# EAGLE design ALIM (EAGLE 9.6.2)

## Sheet 1 of 2: Carte Alim - APU
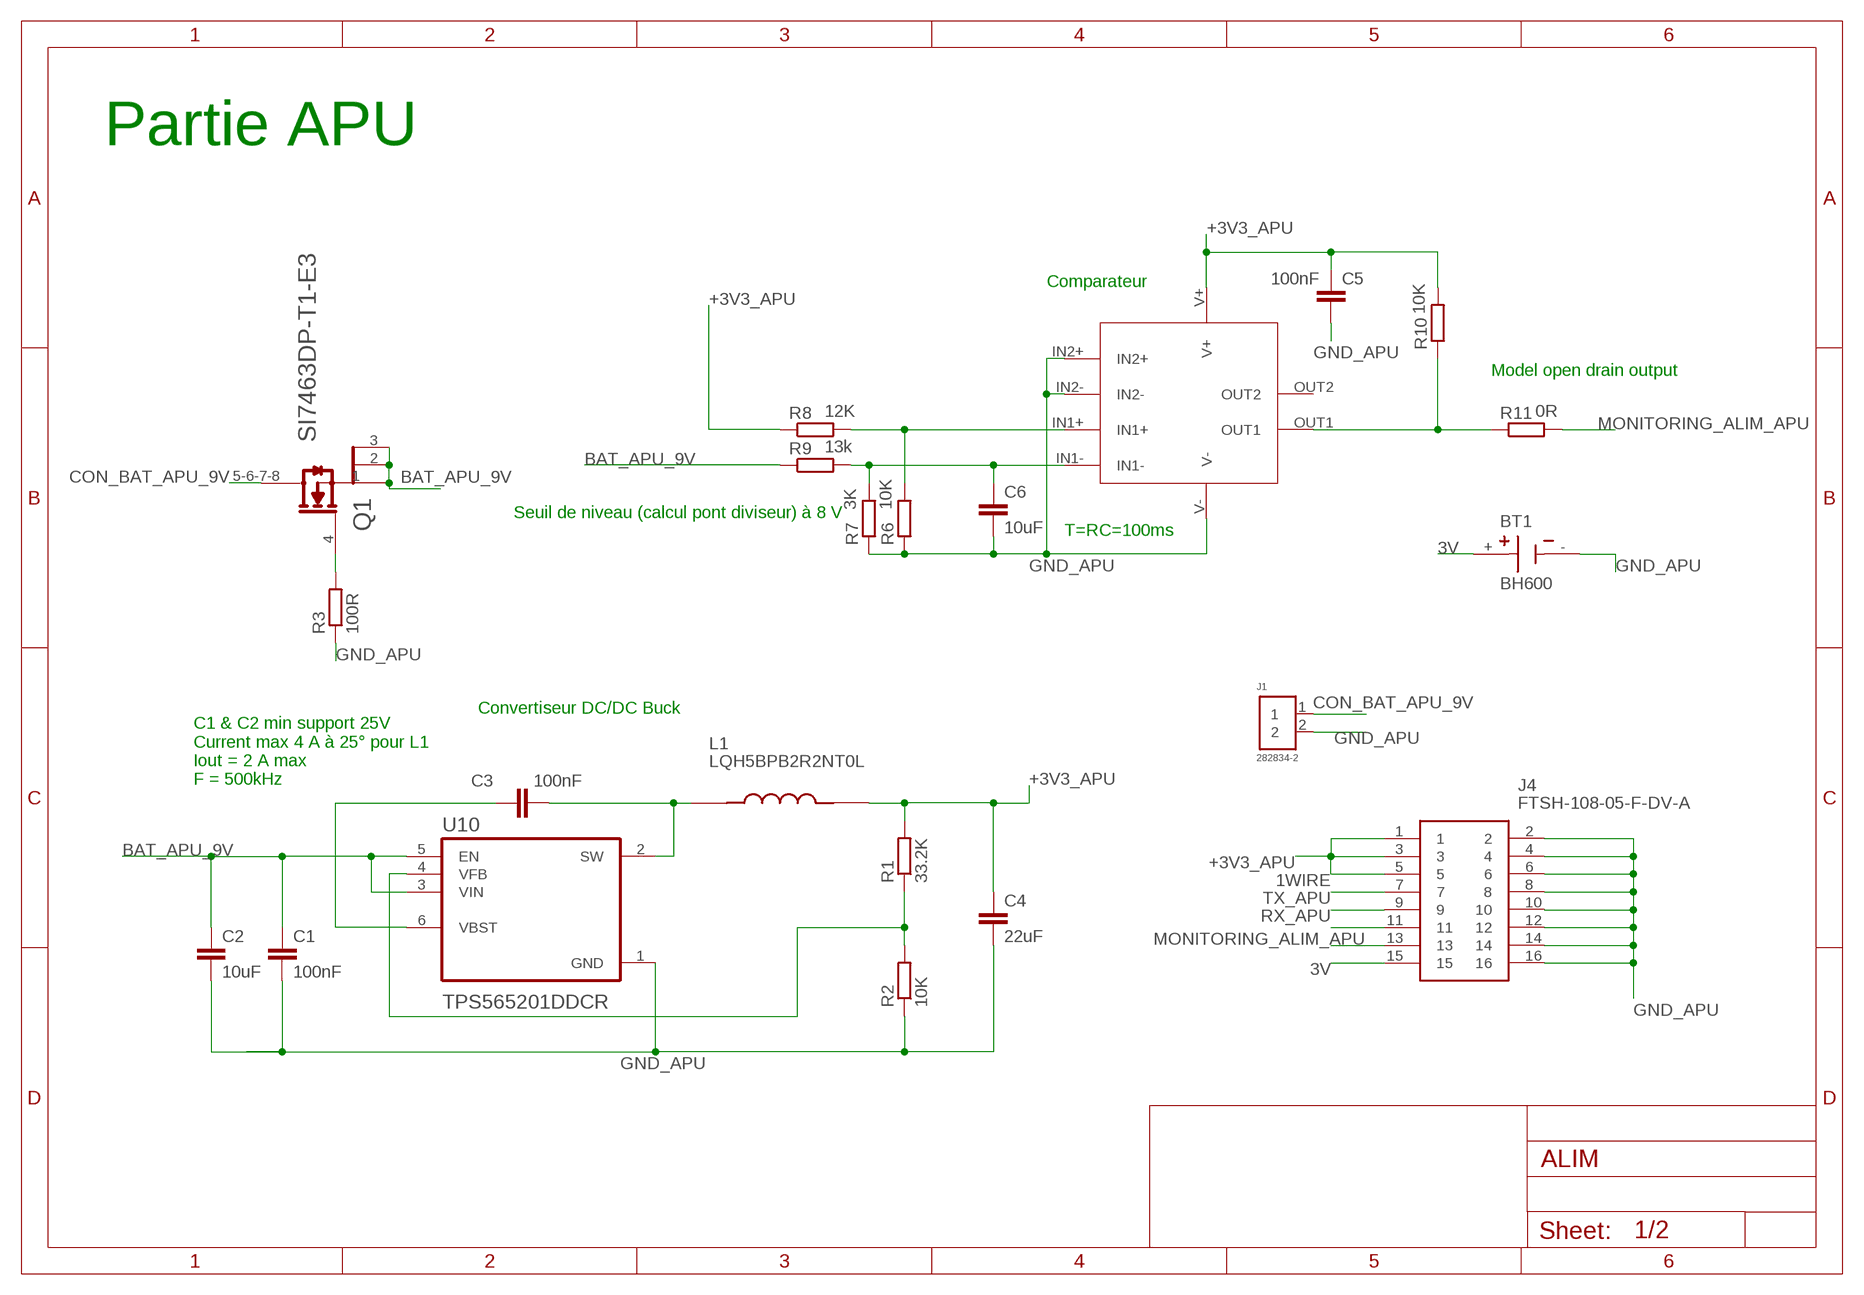
[diagram p0: schematic, sheet 1]

### Parts
BT1  BH600  [BAT_BH600]
C1  100nF  C-EUC0805  [C0805]
C2  10uF  C-EUC0805  [C0805]
C3  100nF  C-EUC0805  [C0805]
C4  22uF  C-EUC0805  [C0805]
C5  100nF  C-EUC0805  [C0805]
C6  10uF  C-EUC0805  [C0805]
J1  282834-2  [CONN_282834-2]
J4  FTSH-108-05-F-DV-A  [FTSH-108-XX-YYY-DV-A]
L1  LQH5BPB2R2NT0L  [IND_LQH5BPB2R2NT0L]
Q1  VISHAY_SI7463DP-T1-E3VISHAY_SI7463DP-T1-E3_0_0  [VISHAY_SI7463DP-T1-E3_0]
R1  33.2K  R-EU_R0603  [R0603]
R2  10K  R-EU_R0603  [R0603]
R3  100R  R-EU_R0603  [R0603]
R6  10K  R-EU_R0603  [R0603]
R7  3K  R-EU_R0603  [R0603]
R8  12K  R-EU_R0603  [R0603]
R9  13k  R-EU_R0603  [R0603]
R10  10K  R-EU_R0603  [R0603]
R11  0R  R-EU_R0603  [R0603]
TLV1  TLV9022  [TLV9022]
U10  TPS565201DDCR  [SOT95P280X110-6N]

### Nets
1WIRE [50Ohms]: J4.7
3V [Power]: BT1.+ J4.15
+3V3_APU [Power]: C4.1 C5.1 J4.1 J4.3 J4.5 L1.2 R1.2 R8.1 R10.2 TLV1.V+
BAT_APU_9V [Power]: C1.1 C2.1 Q1.1(1_S) Q1.2(2_S) Q1.3(3_S) R9.1 U10.3(VIN) U10.5(EN)
CON_BAT_APU_9V: J1.1 Q1.5-6-7-8(D)
GND_APU: BT1.- C1.2 C2.2 C4.2 C5.2 C6.2 J1.2 J4.2 J4.4 J4.6 J4.8 J4.10 J4.12 J4.14 J4.16 R2.1 R3.1 R6.1 R7.1 TLV1.IN2+ TLV1.IN2- TLV1.V- U10.1(GND)
MONITORING_ALIM_APU: J4.13 R11.2
N$1: Q1.4(G) R3.2
N$37: C3.1 U10.6(VBST)
N$38 [Power]: C3.2 L1.1 U10.2(SW)
N$39: R1.1 R2.2 U10.4(VFB)
N$42: R6.2 R8.2 TLV1.IN1+
N$43: C6.1 R7.2 R9.2 TLV1.IN1-
N$45: R10.1 R11.1 TLV1.OUT1
RX_APU [50Ohms]: J4.11
TX_APU [50Ohms]: J4.9
Unconnected: TLV1.OUT2

### Notes on the sheet
- Partie APU
- Comparateur
- Model open drain output
- Seuil de niveau (calcul pont diviseur) à 8 V
- T=RC=100ms
- Convertiseur DC/DC Buck
- C1 & C2 min support 25V
  Current max 4 A à 25° pour L1
  Iout = 2 A max
  F = 500kHz

## Sheet 2 of 2: Carte Alim - Séquenceur
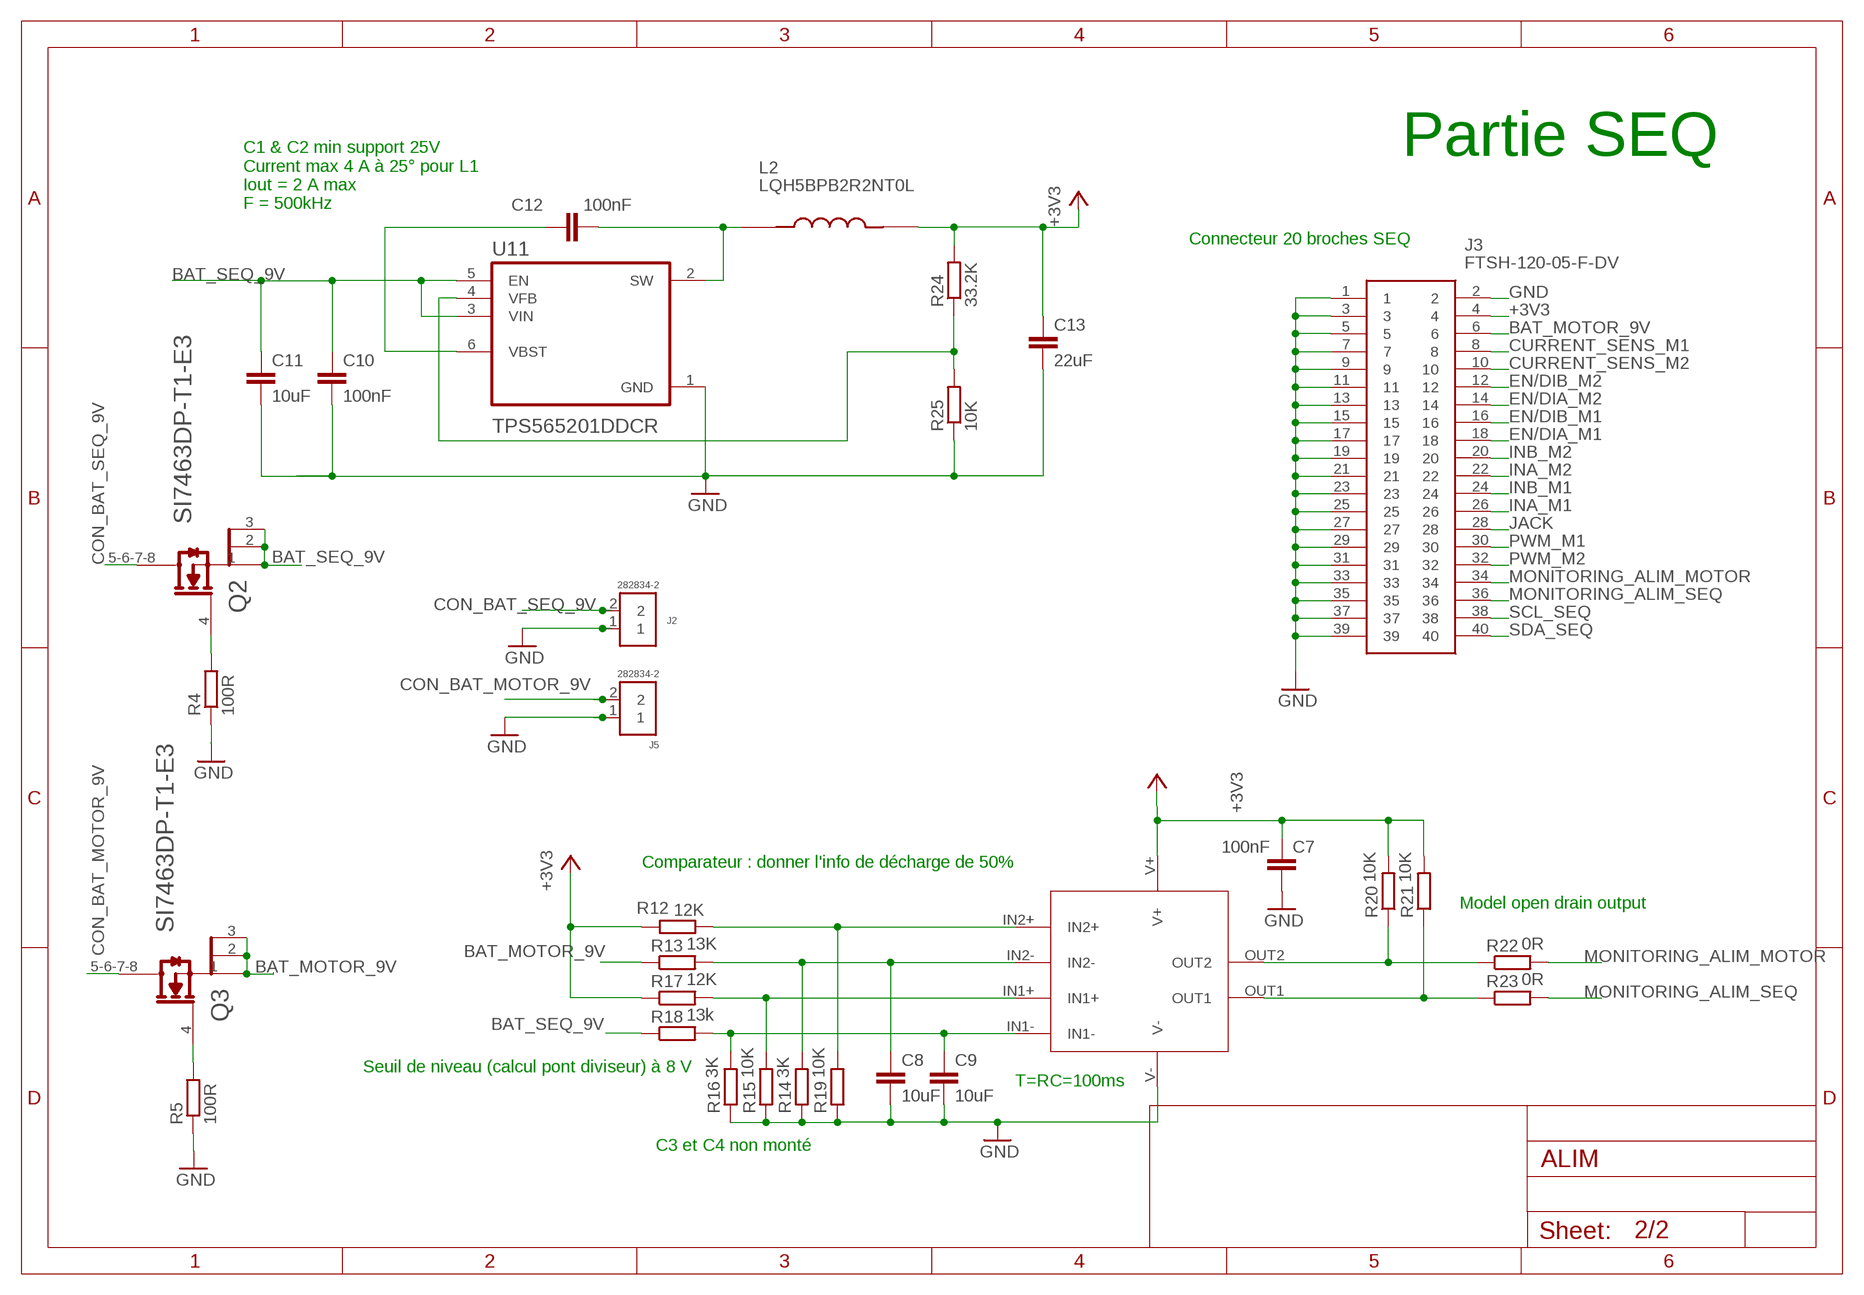
[diagram p1: schematic, sheet 2]

### Parts
C7  100nF  C-EUC0805  [C0805]
C8  10uF  C-EUC0805  [C0805]
C9  10uF  C-EUC0805  [C0805]
C10  100nF  C-EUC0805  [C0805]
C11  10uF  C-EUC0805  [C0805]
C12  100nF  C-EUC0805  [C0805]
C13  22uF  C-EUC0805  [C0805]
J2  282834-2  [CONN_282834-2]
J3  FTSH-120-05-F-DV  [FTSH-120-XX-YYY-DV]
J5  282834-2  [CONN_282834-2]
L2  LQH5BPB2R2NT0L  [IND_LQH5BPB2R2NT0L]
Q2  VISHAY_SI7463DP-T1-E3VISHAY_SI7463DP-T1-E3_0_0  [VISHAY_SI7463DP-T1-E3_0]
Q3  VISHAY_SI7463DP-T1-E3VISHAY_SI7463DP-T1-E3_0_0  [VISHAY_SI7463DP-T1-E3_0]
R4  100R  R-EU_R0603  [R0603]
R5  100R  R-EU_R0603  [R0603]
R12  12K  R-EU_R0603  [R0603]
R13  13K  R-EU_R0603  [R0603]
R14  3K  R-EU_R0603  [R0603]
R15  10K  R-EU_R0603  [R0603]
R16  3K  R-EU_R0603  [R0603]
R17  12K  R-EU_R0603  [R0603]
R18  13k  R-EU_R0603  [R0603]
R19  10K  R-EU_R0603  [R0603]
R20  10K  R-EU_R0603  [R0603]
R21  10K  R-EU_R0603  [R0603]
R22  0R  R-EU_R0603  [R0603]
R23  0R  R-EU_R0603  [R0603]
R24  33.2K  R-EU_R0603  [R0603]
R25  10K  R-EU_R0603  [R0603]
TLV2  TLV9022  [TLV9022]
U11  TPS565201DDCR  [SOT95P280X110-6N]

### Nets
+3V3 [Power]: C7.1 C13.1 J3.4 L2.2 R12.2 R17.1 R20.2 R21.2 R24.2 TLV2.V+
BAT_MOTOR_9V [1A_MOTOR]: J3.6 Q3.1(1_S) Q3.2(2_S) Q3.3(3_S) R13.1
BAT_SEQ_9V [Power]: C10.1 C11.1 Q2.1(1_S) Q2.2(2_S) Q2.3(3_S) R18.1 U11.3(VIN) U11.5(EN)
CON_BAT_MOTOR_9V: J5.2 Q3.5-6-7-8(D)
CON_BAT_SEQ_9V [Power]: J2.2 Q2.5-6-7-8(D)
CURRENT_SENS_M1: J3.8
CURRENT_SENS_M2: J3.10
EN/DIA_M1: J3.18
EN/DIA_M2: J3.14
EN/DIB_M1: J3.16
EN/DIB_M2: J3.12
GND: C7.2 C8.2 C9.2 C10.2 C11.2 C13.2 J2.1 J3.1 J3.2 J3.3 J3.5 J3.7 J3.9 J3.11 J3.13 J3.15 J3.17 J3.19 J3.21 J3.23 J3.25 J3.27 J3.29 J3.31 J3.33 J3.35 J3.37 J3.39 J5.1 R4.1 R5.1 R14.1 R15.1 R16.1 R19.1 R25.1 TLV2.V- U11.1(GND)
INA_M1: J3.26
INA_M2: J3.22
INB_M1: J3.24
INB_M2: J3.20
JACK: J3.28
MONITORING_ALIM_MOTOR: J3.34 R22.2
MONITORING_ALIM_SEQ: J3.36 R23.2
N$2: Q2.4(G) R4.2
N$5: Q3.4(G) R5.2
N$46: R12.1 R19.2 TLV2.IN2+
N$47: C8.1 R13.2 R14.2 TLV2.IN2-
N$48: R15.2 R17.2 TLV2.IN1+
N$49: C9.1 R16.2 R18.2 TLV2.IN1-
N$50: R20.1 R22.1 TLV2.OUT2
N$51: R21.1 R23.1 TLV2.OUT1
N$52: C12.1 U11.6(VBST)
N$53 [Power]: C12.2 L2.1 U11.2(SW)
N$54: R24.1 R25.2 U11.4(VFB)
PWM_M1: J3.30
PWM_M2: J3.32
SCL_SEQ [50Ohms]: J3.38
SDA_SEQ [50Ohms]: J3.40

### Notes on the sheet
- Partie SEQ
- C1 & C2 min support 25V
  Current max 4 A à 25° pour L1
  Iout = 2 A max
  F = 500kHz
- Connecteur 20 broches SEQ
- Comparateur : donner l'info de décharge de 50%
- Model open drain output
- Seuil de niveau (calcul pont diviseur) à 8 V
- T=RC=100ms
- C3 et C4 non monté

## Library data of the parts
BT1 = BH600:BH600: BATTERY HOLDER COIN 16MM PC PIN Check prices <https://pricing.snapeda.com/parts/BH600/MPD%20%28Memory/view-part?ref=eda>; AVAILABILITY: Warning; DESCRIPTION: Battery Holder (Open) Coin, 16.0mm 1 Cell PC Pin; MF: MPD (Memory; MP: BH600; PACKAGE: Battery Holder MPD; PRICE: None; PURCHASE-URL: https://pricing.snapeda.com/search/part/BH600/?ref=eda
C1-C13 = rcl:C-EU: CAPACITOR, European symbol; SPICEPREFIX: C
J1 J2 J5 = 282834-2:282834-2: Terminal block; 2.54mm; angled 90°; 0.03÷1mm2; ways: 2; 10A; H: 10mm Check prices <https://pricing.snapeda.com/parts/282834-2/TE%20Connectivity/view-part?ref=eda>; AVAILABILITY: Good; CENTERLINE_PITCH: 2.54 mm[.1 in]; COMMENT: 282834-2; DESCRIPTION: Wire-To-Board Terminal Block, 2, 150 V, 10 A, 30 Awg, 16 Awg, 1.4 Mm; EU_ROHS_COMPLIANCE: Compliant with Exemptions; MF: TE Connectivity; MP: 282834-2; NUMBER_OF_POSITIONS: 2; PACKAGE: None; PRICE: None; PURCHASE-URL: https://pricing.snapeda.com/search/part/282834-2/?ref=eda
J3 = FTSH-120-05-F-DV:FTSH-120-05-F-DV: 40 Position, High Reliability Header Strips, 0.050" pitch Source: Datasheet <http://suddendocs.samtec.com/prints/ftsh-1xx-xx-xxx-dv-xxx-xxx-mkt.pdf>; DESCRIPTION: 40 Position, High Reliability Header Strips, 0.050&quot; pitch; HEIGHT: mm; MANUFACTURER_NAME: SAMTEC; MANUFACTURER_PART_NUMBER: FTSH-120-05-F-DV
J4 = FTSH-108-05-F-DV-A:FTSH-108-05-F-DV-A: 16 Position, High Reliability Header Strips, 0.050" pitch Source: Datasheet <http://suddendocs.samtec.com/prints/ftsh-1xx-xx-xxx-dv-xxx-xxx-mkt.pdf>; ARROW_PART_NUMBER: FTSH-108-05-F-DV-A; ARROW_PRICE-STOCK: https://www.arrow.com/en/products/ftsh-108-05-f-dv-a/samtec; DESCRIPTION: 16 Position, High Reliability Header Strips, 0.050&quot; pitch; HEIGHT: mm; MANUFACTURER_NAME: SAMTEC; MANUFACTURER_PART_NUMBER: FTSH-108-05-F-DV-A; MOUSER_PART_NUMBER: 200-FTSH10805FDVA; MOUSER_PRICE-STOCK: https://www.mouser.co.uk/ProductDetail/Samtec/FTSH-108-05-F-DV-A?qs=PB6%2FjmICvI1admAR1gVHNg%3D%3D
L1 L2 = LQH5BPB2R2NT0L:LQH5BPB2R2NT0L: Inductor Power Chip Shielded Wirewound 1.2uH 30% 100KHz Ferrite 3.1A 0.0228Ohm DCR 2020 T/R Check prices <https://pricing.snapeda.com/parts/LQH5BPB2R2NT0L/Murata/view-part?ref=eda>; AVAILABILITY: Warning; DESCRIPTION: Inductor with Inductance: 2.2uH Tol. +/-30%, Package: 2020 (5050); MF: Murata; MP: LQH5BPB2R2NT0L; PACKAGE: NONSTANDARD; PRICE: None; PURCHASE-URL: https://pricing.snapeda.com/search/part/LQH5BPB2R2NT0L/?ref=eda
Q1-Q3 = Vishay - SI7463DP-T1-E3:VISHAY_SI7463DP-T1-E3: MOSFET 40V 18.6A 5.4W 9.2mohm @ 10V; AUTOMOTIVE: No; CENTROID_NOT_SPECIFIED: No; CONTINUOUS_DRAIN_CURRENT: -11A; DATASHEET: http://www.vishay.com/docs/72440/si7463dp.pdf; DEPLETION_MODE: False; DEVICE_CLASS_L1: Discrete Semiconductors; DEVICE_CLASS_L2: Transistors; DEVICE_CLASS_L3: MOSFETs; DIGIKEY_DESCRIPTION: MOSFET P-CH 40V 11A PPAK SO-8; DIGIKEY_PART_NUMBER: SI7463DP-T1-E3CT-ND; DRAIN_TO_SOURCE_RESISTANCE: 0.0075Ω; DRAIN_TO_SOURCE_VOLTAGE: -40V; FOOTPRINT_VARIANT_NAME_0: Recommended_Land_Pattern; GATE_CHARGE_AT_VGS: 121nC @ -10V; GATE_TO_SOURCE_VOLTAGE: 20V; HEIGHT: 1.17mm; LEAD_FREE: Yes; MAX_FORWARD_DIODE_VOLTAGE: -1.2V; MAX_JUNCTION_TEMP: +150°C; MF: Vishay; MFG_PACKAGE_IDENT: S17-0173-SINGLE; MFG_PACKAGE_IDENT_DATE: 02/2017; MFG_PACKAGE_IDENT_REV: L; MOUSER_DESCRIPTION: MOSFET 40V 18.6A 5.4W 9.2mohm @ 10V; MOUSER_PART_NUMBER: 781-SI7463DP-T1-E3; MPN: SI7463DP-T1-E3; NUMBER_OF_CHANNELS: 1; NUMBER_OF_P_CHANNELS: 1; PACKAGE: PowerPAKSO-8; POWER_DISSIPATION: 1.9W; PREFIX: Q; PULSE_DRAIN_CURRENT: -60A; REVERSE_RECOVERY_TIME: 45ns; ROHS: Yes; RTHJA_MAX: 52°C/W; STANDOFF_HEIGHT: 0mm; TEMPERATURE_RANGE_HIGH: +150°C; TEMPERATURE_RANGE_LOW: -55°C; THRESHOLD_VGS_MAX: -3V; THRESHOLD_VGS_MIN: -1V; TRANSCONDUCTANCE: 50S; TURN_OFF_DELAY_TIME: 200ns; TURN_ON_DELAY_TIME: 20ns; TYP_FORWARD_DIODE_VOLTAGE: -0.8V; VERIFICATION_VERSION: 0.0.0.3
R1-R25 = rcl:R-EU_: RESISTOR, European symbol; SPICEPREFIX: R
TLV1 TLV2 = TLV9022:TLV9022
U10 U11 = TPS565201DDCR:TPS565201DDCR: Check prices <https://pricing.snapeda.com/parts/TPS565201DDCR/Texas%20Instruments/view-part?ref=eda>; AVAILABILITY: Warning; DESCRIPTION: 4.5V to 17V, 5A, Synchronous Step-Down Voltage Regulator in SOT23 6-SOT-23-THIN -40 to 125; MF: Texas Instruments; MP: TPS565201DDCR; PACKAGE: SOT-23-THN-6 Texas Instruments; PRICE: None; PURCHASE-URL: https://pricing.snapeda.com/search/part/TPS565201DDCR/?ref=eda

## Net classes
0 default: width 0.2 mm, clearance 0.127 mm
1 Power: width 0.4 mm, clearance 0.2 mm
2 50Ohms: width 0.147 mm, clearance 0.127 mm
3 1A_MOTOR: width 1 mm, clearance 0.2 mm

## Board
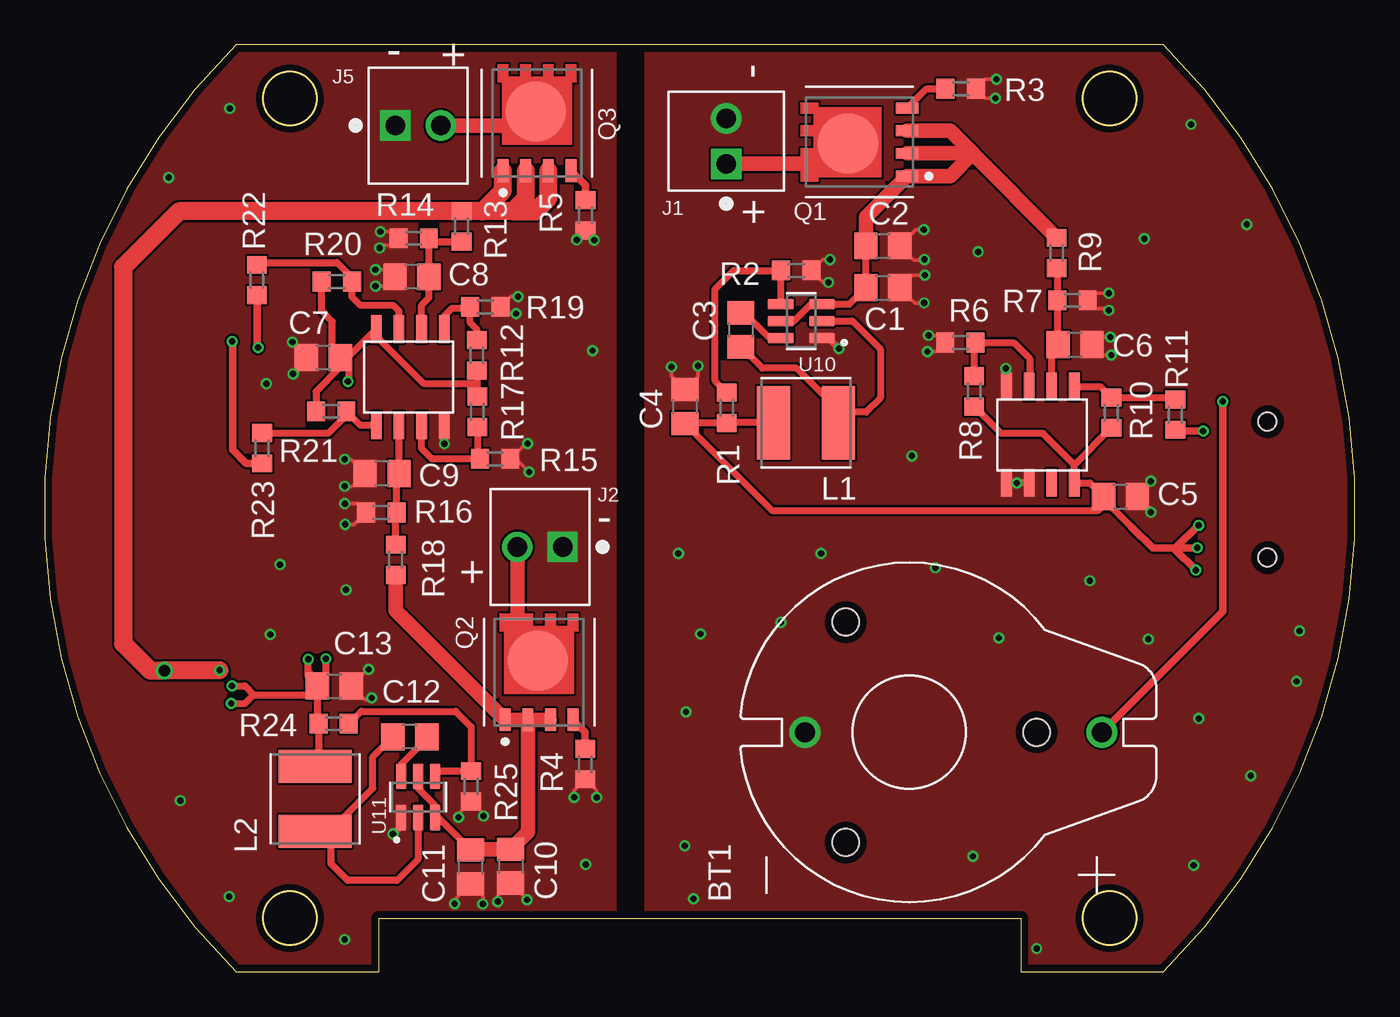
[diagram p2: board, top side]
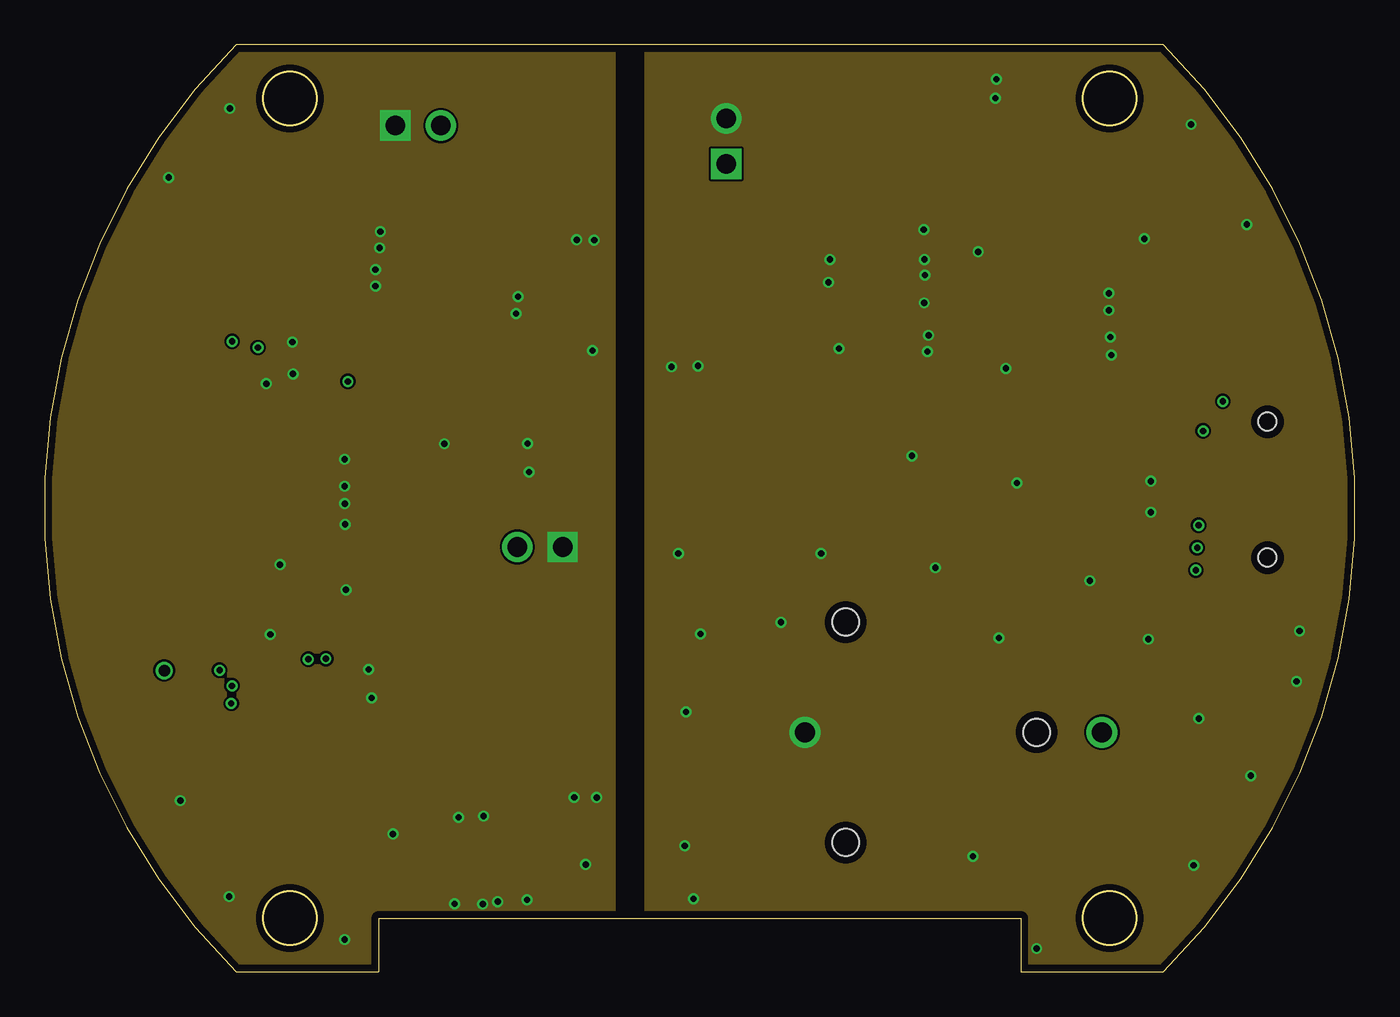
[diagram p3: board, inner layer Route2]
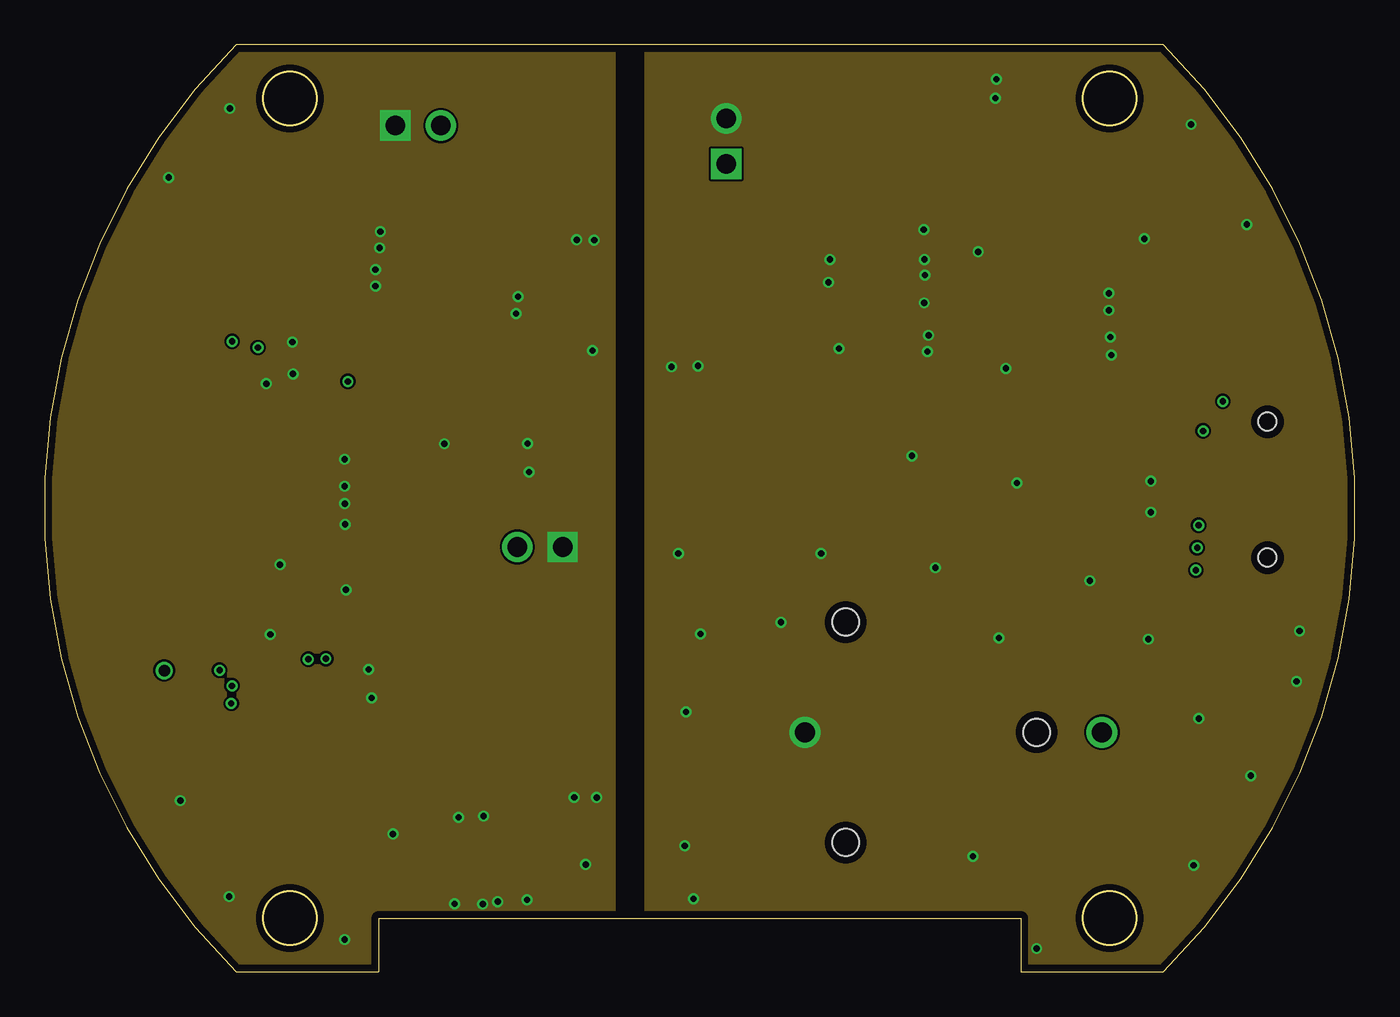
[diagram p4: board, inner layer Route15]
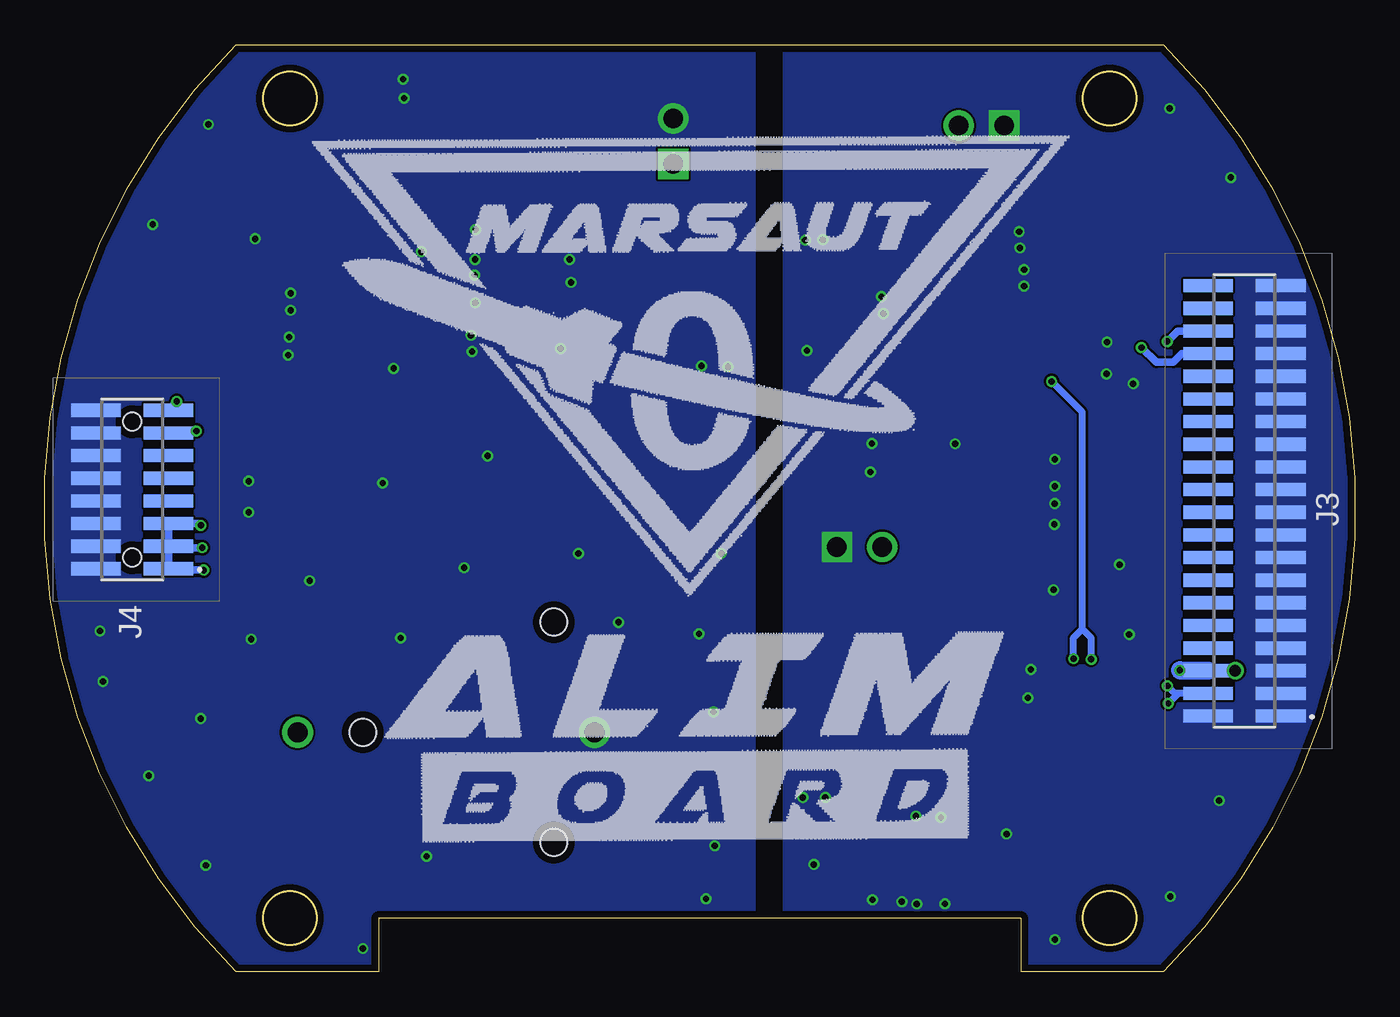
[diagram p5: board, bottom side, seen from below]

Size 73.46 x 52 mm. Coordinates in mm from the lower left corner, seen from the top.
Outline: 18.73,3 54.73,3 54.73,0 62.73,0 arc90 62.73,52 10.73,52 arc90 10.73,0 18.73,0 18.73,3
Outline: circle at 59.71,48.98 radius 1.5
Outline: circle at 13.75,3.02 radius 1.5
Outline: circle at 13.75,48.98 radius 1.5
Outline: circle at 59.71,3.02 radius 1.5
Copper layers (1+2*15+16): Top 0.035mm / dielectric 0.1mm / Route2 0.0175mm / dielectric 1.265mm / Route15 0.0175mm / dielectric 0.1mm / Bottom 0.035mm
Design rules "Marsaut0": minimum track width 3.5mil, minimum drill 0.2mm, track to track 4mil, track to pad 0.2mm, pad to pad 5mil, via to via 0.5mm, smd to smd 5mil, copper to edge 0.4mm, drill to drill 0.5mm, minimum pad ring 0.3mm, minimum via ring 0.13mm, stop-mask expansion 4mil, vias tented up to drill 0mil, thermal gap 10mil

### Footprints (pad centres in the part's own frame; a part is rotated, then mirrored left to right if it is on the bottom)
BAT_BH600 = drill 1.13 pad 1.7: + 0,-10.8; - 0,5.86 | hole 1.52: 0,-7.135; 6.179,3.567; -6.179,3.567
C0805 = smd 1.3 x 1.5: 1 -0.95,0; 2 0.95,0
CONN_282834-2 = drill 1.1 square: 1 -1.27,0 | drill 1.1: 2 1.27,0
FTSH-120-XX-YYY-DV = smd 0.74 x 2.79: 1 -12.065,-2.035; 2 -12.065,2.035; 3 -10.795,-2.035; 4 -10.795,2.035; 5 -9.525,-2.035; 6 -9.525,2.035; 7 -8.255,-2.035; 8 -8.255,2.035; 9 -6.985,-2.035; 10 -6.985,2.035; 11 -5.715,-2.035; 12 -5.715,2.035; 13 -4.445,-2.035; 14 -4.445,2.035; 15 -3.175,-2.035; 16 -3.175,2.035; 17 -1.905,-2.035; 18 -1.905,2.035; 19 -0.635,-2.035; 20 -0.635,2.035; 21 0.635,-2.035; 22 0.635,2.035; 23 1.905,-2.035; 24 1.905,2.035; 25 3.175,-2.035; 26 3.175,2.035; 27 4.445,-2.035; 28 4.445,2.035; 29 5.715,-2.035; 30 5.715,2.035; 31 6.985,-2.035; 32 6.985,2.035; 33 8.255,-2.035; 34 8.255,2.035; 35 9.525,-2.035; 36 9.525,2.035; 37 10.795,-2.035; 38 10.795,2.035; 39 12.065,-2.035; 40 12.065,2.035
FTSH-108-XX-YYY-DV-A = smd 0.74 x 2.79: 1 -4.445,-2.035; 2 -4.445,2.035; 3 -3.175,-2.035; 4 -3.175,2.035; 5 -1.905,-2.035; 6 -1.905,2.035; 7 -0.635,-2.035; 8 -0.635,2.035; 9 0.635,-2.035; 10 0.635,2.035; 11 1.905,-2.035; 12 1.905,2.035; 13 3.175,-2.035; 14 3.175,2.035; 15 4.445,-2.035; 16 4.445,2.035 | hole 1.02: -3.81,0; 3.81,0
IND_LQH5BPB2R2NT0L = smd 1.85 x 4.1: 1 -1.825,0; 2 1.825,0
VISHAY_SI7463DP-T1-E3_0 = smd 1.27 x 0.61: 1 -2.67,1.905; 2 -2.67,0.635; 3 -2.67,-0.635; 4 -2.67,-1.905 | smd 3.356 x 3.356: 5-6-7-8 0.645,0.069
R0603 = smd 1 x 1.1: 1 -0.85,0; 2 0.85,0
TLV9022 = smd 1.55 x 0.6: IN1+ -2.71,-0.73; IN1- -2.71,0.54; IN2+ 2.69,-2; IN2- 2.69,-0.73; OUT1 -2.71,1.81; OUT2 2.69,0.54; V+ 2.69,1.81; V- -2.71,-2
SOT95P280X110-6N = smd 1.45 x 0.59: 1 -1.155,0.95; 2 -1.155,0; 3 -1.155,-0.95; 4 1.155,-0.95; 5 1.155,0; 6 1.155,0.95

### Placement (x,y rotation side)
BT1  48.48,13.44 90 top
C1  46.99,38.37 0 top
C2  46.99,40.72 0 top
C3  39.03,36.01 270 top
C4  35.91,31.7 90 top
C5  60.32,26.66 0 top
C6  57.77,35.18 0 top
C7  15.63,34.45 180 top
C8  20.59,38.97 180 top
C9  18.92,27.95 180 top
C10  26.13,5.93 270 top
C11  23.88,5.89 270 top
C12  20.48,13.19 180 top
C13  16.25,16.04 0 top
J1  38.22,46.58 90 top
J2  27.77,23.83 180 top
J3  6.19,26.42 90 bottom
J4  68.55,27.05 90 bottom
J5  20.94,47.46 0 top
L1  42.69,30.8 180 top
L2  15.16,9.72 90 top
Q1  45.68,46.53 180 top
Q2  27.73,16.81 90 top
Q3  27.6,47.6 90 top
R1  38.25,31.64 270 top
R2  42.14,39.33 180 top
R3  51.36,49.53 180 top
R4  30.31,11.66 90 top
R5  30.33,42.42 90 top
R6  51.34,35.29 0 top
R7  57.62,37.66 180 top
R8  52.12,32.56 90 top
R9  56.74,40.31 270 top
R10  59.81,31.36 270 top
R11  63.4,31.25 270 top
R12  24.23,34.58 270 top
R13  23.38,41.81 270 top
R14  20.69,41.14 0 top
R15  25.26,28.77 180 top
R16  18.88,25.76 0 top
R17  24.27,31.41 270 top
R18  19.68,23.1 90 top
R19  24.71,37.29 180 top
R20  16.39,38.71 180 top
R21  16.07,31.43 180 top
R22  11.91,38.79 270 top
R23  12.2,29.37 270 top
R24  16.2,13.92 180 top
R25  23.91,10.41 90 top
TLV1  55.92,30.11 270 top
TLV2  20.41,33.36 90 top
U10  42.43,36.5 180 top
U11  20.94,9.82 90 top

### Tracks (layer width: path | path; a pad name or v marks a point on that pad's centre or on a via)
3V  (via drill 0.35)
  Top 0.406: BT1.+ 66.05,20.21 v66.05,31.99
  Bottom 0.406: J4.15 66.52,31.52 v66.05,31.98 v66.05,31.99
+3V3  (via drill 0.35)
  Top 0.4: L2.2 15.35,11.73 R24.2 15.3,13.98 C13.1 | R17.1 24.27,33 | 24.27,33 24.27,33.7 R12.2 | C7.1 17,34.45 TLV2.V+ 18.6,35.66 21.26,33 24.27,33 | C7.1 16.13,34.9 16.13,36.48 15.53,37.08 15.53,38.7 R20.2 | C7.1 16.58,33.91 15.22,32.54 R21.2 | C7.1 17.03,33.99 17.03,33.11 v17,33.11 | v10.51,16.05 11.24,16.05 11.73,15.55 | 11.73,15.55 14.81,15.55 C13.1 | v10.46,15.06 11.25,15.06 11.73,15.55 | 14.79,16.55 14.79,16.86 | 14.79,16.86 v14.79,17.53 | 15.77,16.51 v15.77,17.57 | 14.79,16.86 15.3,16.35 C13.1
  Bottom 0.4: v17,33.11 15.28,31.39 15.28,19.23 15.28,19.22 | v10.51,16.05 10.08,15.62 J3.4 9.9,15.62 v10.46,15.06 | v14.79,17.53 14.79,18.73 15.28,19.22 | v15.77,17.57 15.77,18.73 15.28,19.22
+3V3_APU  (via drill 0.35)
  Top 0.4: L1.2 R1.2 35.94,30.79 C4.1 40.77,25.89 59.09,25.89 59.37,26.17 C5.1 | C5.1 58.6,27.42 TLV1.V+ 57.73,28.44 | 57.73,28.44 R10.2 | 57.73,28.44 55.98,30.19 53.63,30.19 R8.1 | C5.1 59.37,26.53 60.94,24.96
  Top 0.406: 60.94,24.96 62.12,23.78 63.4,23.78 | v64.62,23.79 v64.61,23.78 63.4,23.78 | 63.4,23.78 64.67,25.04 v64.7,25.04 | 63.4,23.78 63.4,23.67 v64.54,22.53
  Bottom 0.406: v64.62,23.79 66.43,23.79 | 66.43,23.79 J4.3 J4.5 64.8,25.15 v64.7,25.04 | v64.54,22.53 66.44,22.53 J4.1 66.52,23.7 66.43,23.79
BAT_APU_9V
  Top 0.4: C1.1 | C1.1 45.12,37.45 U10.3 42.97,37.45 42.02,36.5 U10.5 | C1.1 C2.1 | C2.1
  Top 0.813: Q1.3 50.78,47.17 52.05,45.9 | Q1.2 51.72,45.9 52,45.9 | 52,45.9 52.05,45.9 | 52,45.9 52.05,45.9 | 52,45.9 R9.1 | 52.05,45.9 50.78,44.63 Q1.1 46.04,42.31 C2.1
BAT_MOTOR_9V  (via drill 0.35, 0.65)
  Top 1: Q3.2 26.97,43.36 26.27,42.66 | 26.27,42.66 24.54,42.66 | 24.54,42.66 R13.1 7.54,42.66 4.41,39.52 4.41,18.42 5.92,16.9 v6.71,16.9 6.72,16.92 v9.81,16.92 | 24.54,42.66 25.7,43.81 Q3.1 | 26.27,42.66 27.53,42.66 28.25,43.38 Q3.3
  Bottom 1: J3.6 9.78,16.89 v9.81,16.92
BAT_SEQ_9V
  Top 0.4: C11.1 22.06,8.66 U11.3 21.89,9.35 20.94,10.3 U11.5 | 28.32,14.1 Q2.3 | Q2.2 27.1,14.15 27.11,14.15
  Top 0.406: 27.11,14.15 27.12,14.14
  Top 0.813: C11.1 23.91,6.88 C10.1 27.09,7.84 Q2.2 | R18.1 19.68,20.28 Q2.1 Q2.2 | Q2.2 28.27,14.14 28.32,14.1
CON_BAT_APU_9V
  Top 0.813: J1.1 44.69,45.31 45.07,45.69 45.07,46.44 Q1.5-6-7-8
CON_BAT_MOTOR_9V
  Top 0.406: 27.56,47.46 27.95,47.85 27.56,48.24 Q3.5-6-7-8
  Top 0.813: J5.2 27.56,47.46
CON_BAT_SEQ_9V
  Top 0.813: J2.2 26.5,18.57 28.01,17.06 28.01,17.11 Q2.5-6-7-8
GND  (via drill 0.35)
  Top 0.2: v27.16,28.03 26.42,28.77 R15.1 26.13,28.77 26.85,29.49 26.94,29.49 v27.08,29.63 | R14.1 19.46,41.51 v18.82,41.51 | 19.8,41.09 19.45,40.75 18.79,40.75 v18.79,40.6 | v18.55,38.46 19.13,38.46 C8.2 19.23,39.38 v18.55,39.38 | v26.43,36.92 25.92,36.92 R19.1 26.14,37.87 v26.55,37.87 | v16.82,28.75 16.82,28.74 17.18,28.74 C9.2 17.25,27.23 v16.82,27.23 | v16.83,26.26 17.53,26.26 R16.1 17.36,25.1 v16.84,25.1 | v18.16,16.96 18.12,16.96 C13.2 17.95,15.29 18.33,15.29 v18.33,15.37 | v24.61,8.74 v24.6,8.74 24.6,8.87 R25.1 23.21,8.86 v23.21,8.66 | v29.69,9.79 29.69,10.19 R4.1 30.95,10.17 v30.95,9.78 | v27.04,4.05 27.04,4.08 C10.2 25.4,4.26 v25.4,3.95 | v22.98,3.83 22.98,4.05 C11.2 24.57,4.25 v24.57,3.81 v24.56,3.81
  Top 0.4: TLV2.V- v22.41,29.62 v22.41,29.61 | v13.93,33.54 13.93,33.54 14.68,34.28 C7.2 14.68,34.52 v13.89,35.31 | C9.2 17.96,27.94 | R14.1 19.8,41.09 | C10.2 26.1,4.96 | U11.1 19.99,8.17 19.55,7.74 v19.53,7.74
  Top 0.406: v29.83,41.05 30.33,41.55 R5.1 30.33,41.53 v30.81,41.04
  other vias: 30.34,6.03 7.61,9.61 6.96,44.55 12.43,32.99 13.2,22.84 12.65,18.92 10.35,4.23 16.83,1.82 16.9,21.43 30.73,34.84 10.38,48.42
  pour Bottom (no thermals): 31.86,-0.23 31.86,52.5 10.7,52.5 10.61,52.6 -2.82,39.17 -2.82,18.46 -2.52,18.16 -2.59,18.16 -2.75,18.31 -2.75,11.99 9.98,-0.73 31.88,-0.73 31.89,-0.74 31.89,0 31.86,0.02
  pour Route2 (no thermals): 31.85,-0.24 31.85,52.33 31.7,52.48 10.6,52.48 10.51,52.57 -2.84,39.23 -2.84,18.45 -2.53,18.15 -2.61,18.15 -2.76,18.3 -2.76,11.98 9.97,-0.74 31.86,-0.74 31.87,-0.75 31.87,-0.01 31.85,0.01
  pour Route15 (no thermals): 31.85,-0.32 31.85,52.25 31.7,52.4 10.6,52.4 10.52,52.48 -2.84,39.12 -2.84,18.37 -2.53,18.06 -2.61,18.06 -2.72,18.17 -2.72,11.86 9.97,-0.83 31.86,-0.83 31.87,-0.83 31.87,-0.09 31.85,-0.07
  pour Top (no thermals): 31.89,-0.28 31.89,52.51 10.56,52.51 10.56,52.52 -2.8,39.16 -2.8,18.41 -2.49,18.1 -2.57,18.1 -2.72,18.25 -2.72,11.94 10.01,-0.79 31.9,-0.79 31.91,-0.79 31.91,-0.05 31.89,-0.03
GND_APU  (via drill 0.35)
  Top 0.2: v53.36,50.05 52.73,50.05 R3.1 52.74,48.99 v53.3,48.99 | v49.29,41.62 48.84,41.62 C2.2 48.75,39.91 49.33,39.91 v49.33,39.95 | v49.35,39.08 v49.35,39.07 48.64,39.07 C1.2 48.79,37.52 v49.31,37.52 | v44.02,39.95 v44.02,39.94 43.6,39.94 R2.1 43.65,38.67 v43.95,38.67 v43.94,38.66 43.66,38.66 | v36.63,33.98 36.63,33.38 C4.2 35.15,33.41 v35.15,33.93 | 50.45,35.33 50.09,35.7 v49.56,35.7 | R6.1 49.99,34.78 v49.5,34.78 | 58.5,37.69 58.87,38.06 v59.67,38.06 | R7.1 58.94,37.19 59.66,37.19 v59.66,37.1 | v59.74,35.6 59.14,35.6 C6.2 59.31,34.59 v59.81,34.59
  Top 0.4: TLV1.V- 53.89,32.86 v53.89,33.83 v53.89,33.84 | TLV1.IN2- v54.51,27.42 TLV1.IN2+ | v62.03,27.52 | v62.03,27.52 61.27,26.76 C5.2 61.27,26.57 62.03,25.82 v62.03,25.78 | R7.1 58.5,37.69 | R6.1 50.45,35.33 | U10.1 43.95,35.55 v44.54,34.96
  other vias: 64.28,47.53 61.66,41.11 67.41,41.91 52.34,40.38 70.19,16.29 70.36,19.12 48.63,28.94 35.53,23.47 36.77,18.95 35.97,14.58 35.89,7.07 36.38,4.11 52.05,6.49 55.62,1.31 64.42,5.98 67.62,11.01 64.71,14.21 61.87,18.66 58.6,21.94 53.5,18.73 49.94,22.67 43.53,23.47 41.28,19.61
  pour Bottom (no thermals): 33.82,52.2 33.82,-0.82 34.01,-1.01 76.83,-1.01 76.83,53.21 33.84,53.72 33.82,53.7 33.82,52.22
  pour Route15 (no thermals): 33.82,52.16 33.82,-0.86 34.01,-1.05 76.83,-1.05 76.83,53.17 76.32,53.68 33.84,53.68 33.82,53.66 33.82,52.18
  pour Route2 (no thermals): 33.82,52.16 33.82,-0.86 34.01,-1.05 76.83,-1.05 76.83,53.17 76.32,53.68 33.84,53.68 33.82,53.66 33.82,52.18
  pour Top (no thermals): 33.82,52.16 33.82,-0.86 34.01,-1.05 76.83,-1.05 76.83,53.17 76.32,53.68 33.84,53.68 33.82,53.66 33.82,52.18
MONITORING_ALIM_APU  (via drill 0.35)
  Top 0.406: v64.95,30.33 63.46,30.33 R11.2
  Bottom 0.406: v64.95,30.33 66.41,30.33 J4.13
MONITORING_ALIM_MOTOR  (via drill 0.35)
  Top 0.406: v11.96,35.01 11.91,35.07 R22.2
  Bottom 0.406: J3.34 9.7,34.67 10.18,34.19 11.14,34.19 v11.96,35.01
MONITORING_ALIM_SEQ  (via drill 0.35)
  Top 0.406: R23.2 11.31,28.52 10.55,29.28 10.55,35.32 v10.52,35.36
  Bottom 0.406: v10.52,35.36 9.93,35.94 J3.36
N$1
  Top 0.4: Q1.4 49.44,49.53 R3.2
N$2
  Top 0.406: R4.2 30.31,13.46 Q2.4
N$5
  Top 0.406: Q3.4 30.33,44.11 R5.2
N$37
  Top 0.4: U10.6 40.64,35.55 39.24,36.96 C3.1
N$38
  Top 0.4: U10.2 45.29,36.5 46.86,34.93 46.86,32.19 46.05,31.38 44.61,31.38 | C3.2 40.23,33.85 42.14,33.85 44.61,31.38 | L1.1 44.52,31.29 44.61,31.38
N$39
  Top 0.4: U10.4 41.27,39.32 R2.2 38.63,39.33 37.59,38.3 37.59,33.15 R1.1
N$42
  Top 0.4: R8.2 52.12,35.22 R6.2 54.33,35.29 55.23,34.39 55.23,32.87 TLV1.IN1+
N$43
  Top 0.4: R9.2 56.77,39.43 R7.2 56.77,35.23 | 56.77,35.23 C6.1 | TLV1.IN1- 56.46,34.92 56.77,35.23
N$45
  Top 0.4: TLV1.OUT1 59.2,32.82 R10.1 63.28,32.21 R11.1
N$46
  Top 0.4: R12.1 24.23,36.02 23.86,36.4 R19.2 23.77,37.2 22.83,37.2 22.41,36.78 TLV2.IN2+
N$47
  Top 0.4: TLV2.IN2- 21.14,37.39 21.54,37.8 C8.1 R14.2 21.72,40.96 R13.2
N$48
  Top 0.4: R17.2 24.27,28.91 R15.2 21.71,28.77 21.14,29.34 TLV2.IN1+
N$49
  Top 0.4: R18.2 19.68,25.72 R16.2 19.73,27.81 C9.1 TLV2.IN1-
N$50
  Top 0.4: TLV2.OUT2 19.87,37.07 19.56,37.37 17.72,37.37 17.24,37.85 R20.1 17.24,38.94 16.4,39.78 12.04,39.78 R22.1
N$51
  Top 0.4: TLV2.OUT1 17.7,30.64 16.96,31.39 | 16.96,31.39 R21.1 | R23.1 15.93,30.22 16.96,31.24 16.96,31.39
N$52
  Top 0.4: C12.1 21.43,13.08 19.99,11.64 U11.6
N$53
  Top 0.4: U11.2 20.94,6.31 19.76,5.13 17,5.13 16.05,6.07 16.05,7.13 | C12.2 18.39,12.05 18.39,10.3 16.05,7.96 16.05,7.13 | L2.1 15.29,7.89 16.05,7.13
N$54
  Top 0.4: U11.4 22.18,11.26 R25.2 23.91,13.76 23.06,14.61 17.75,14.61 R24.1

### Text on the board
tNames: - | + | - | + | - | +
201bmp: C:/Users/paulm/OneDrive/Bureau/Image_Board/ALIM_BOARD256_flipped_black.bmp